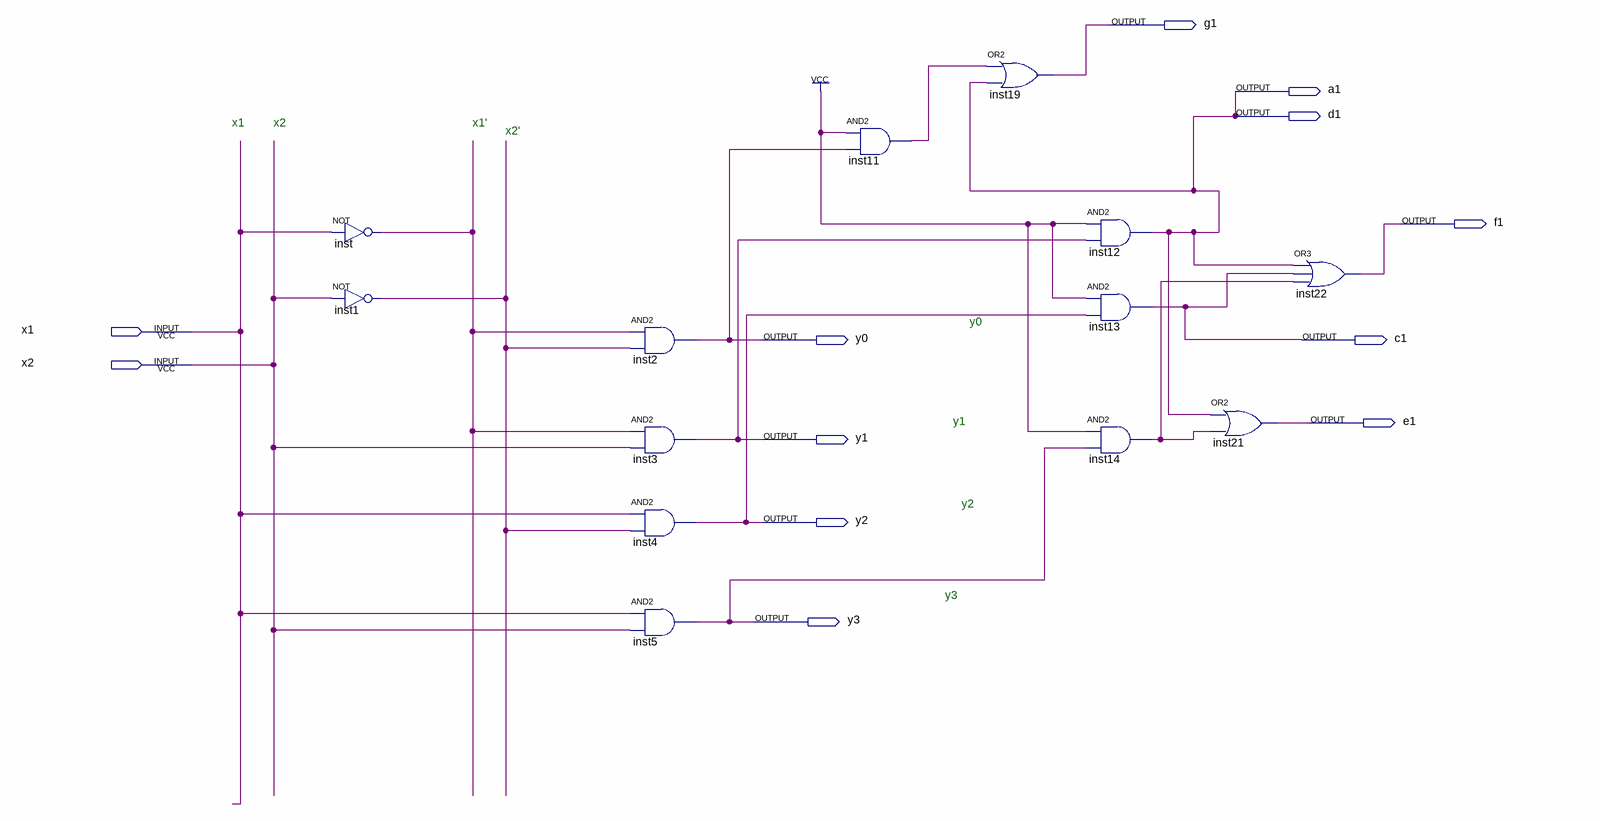
[diagram p0: schematic sheet]
// Quartus schematic Cmb1.bdf as structural Verilog: 13 symbols, 12 pins
module Cmb1 (
  input  x1,
  input  x2,
  output g1,
  output a1,
  output d1,
  output f1,
  output y0,
  output c1,
  output e1,
  output y1,
  output y2,
  output y3
);

  wire inst1_out, inst11_out, inst14_out, inst_out;

  not inst (inst_out, x1);
  not inst1 (inst1_out, x2);
  and inst2 (y0, inst_out, inst1_out);
  and inst3 (y1, inst_out, x2);
  and inst4 (y2, x1, inst1_out);
  and inst5 (y3, x1, x2);
  and inst11 (inst11_out, 1'b1, y0);
  or inst19 (g1, inst11_out, a1);
  and inst12 (a1, 1'b1, y1);
  and inst13 (c1, 1'b1, y2);
  and inst14 (inst14_out, 1'b1, y3);
  or inst21 (e1, a1, inst14_out);
  or inst22 (f1, a1, c1, inst14_out);

  assign d1 = a1;

  // Notes on the sheet:
  //   x1
  //   x2
  //   x1'
  //   x2'
  //   y0
  //   y1
  //   y2
  //   y3
endmodule
